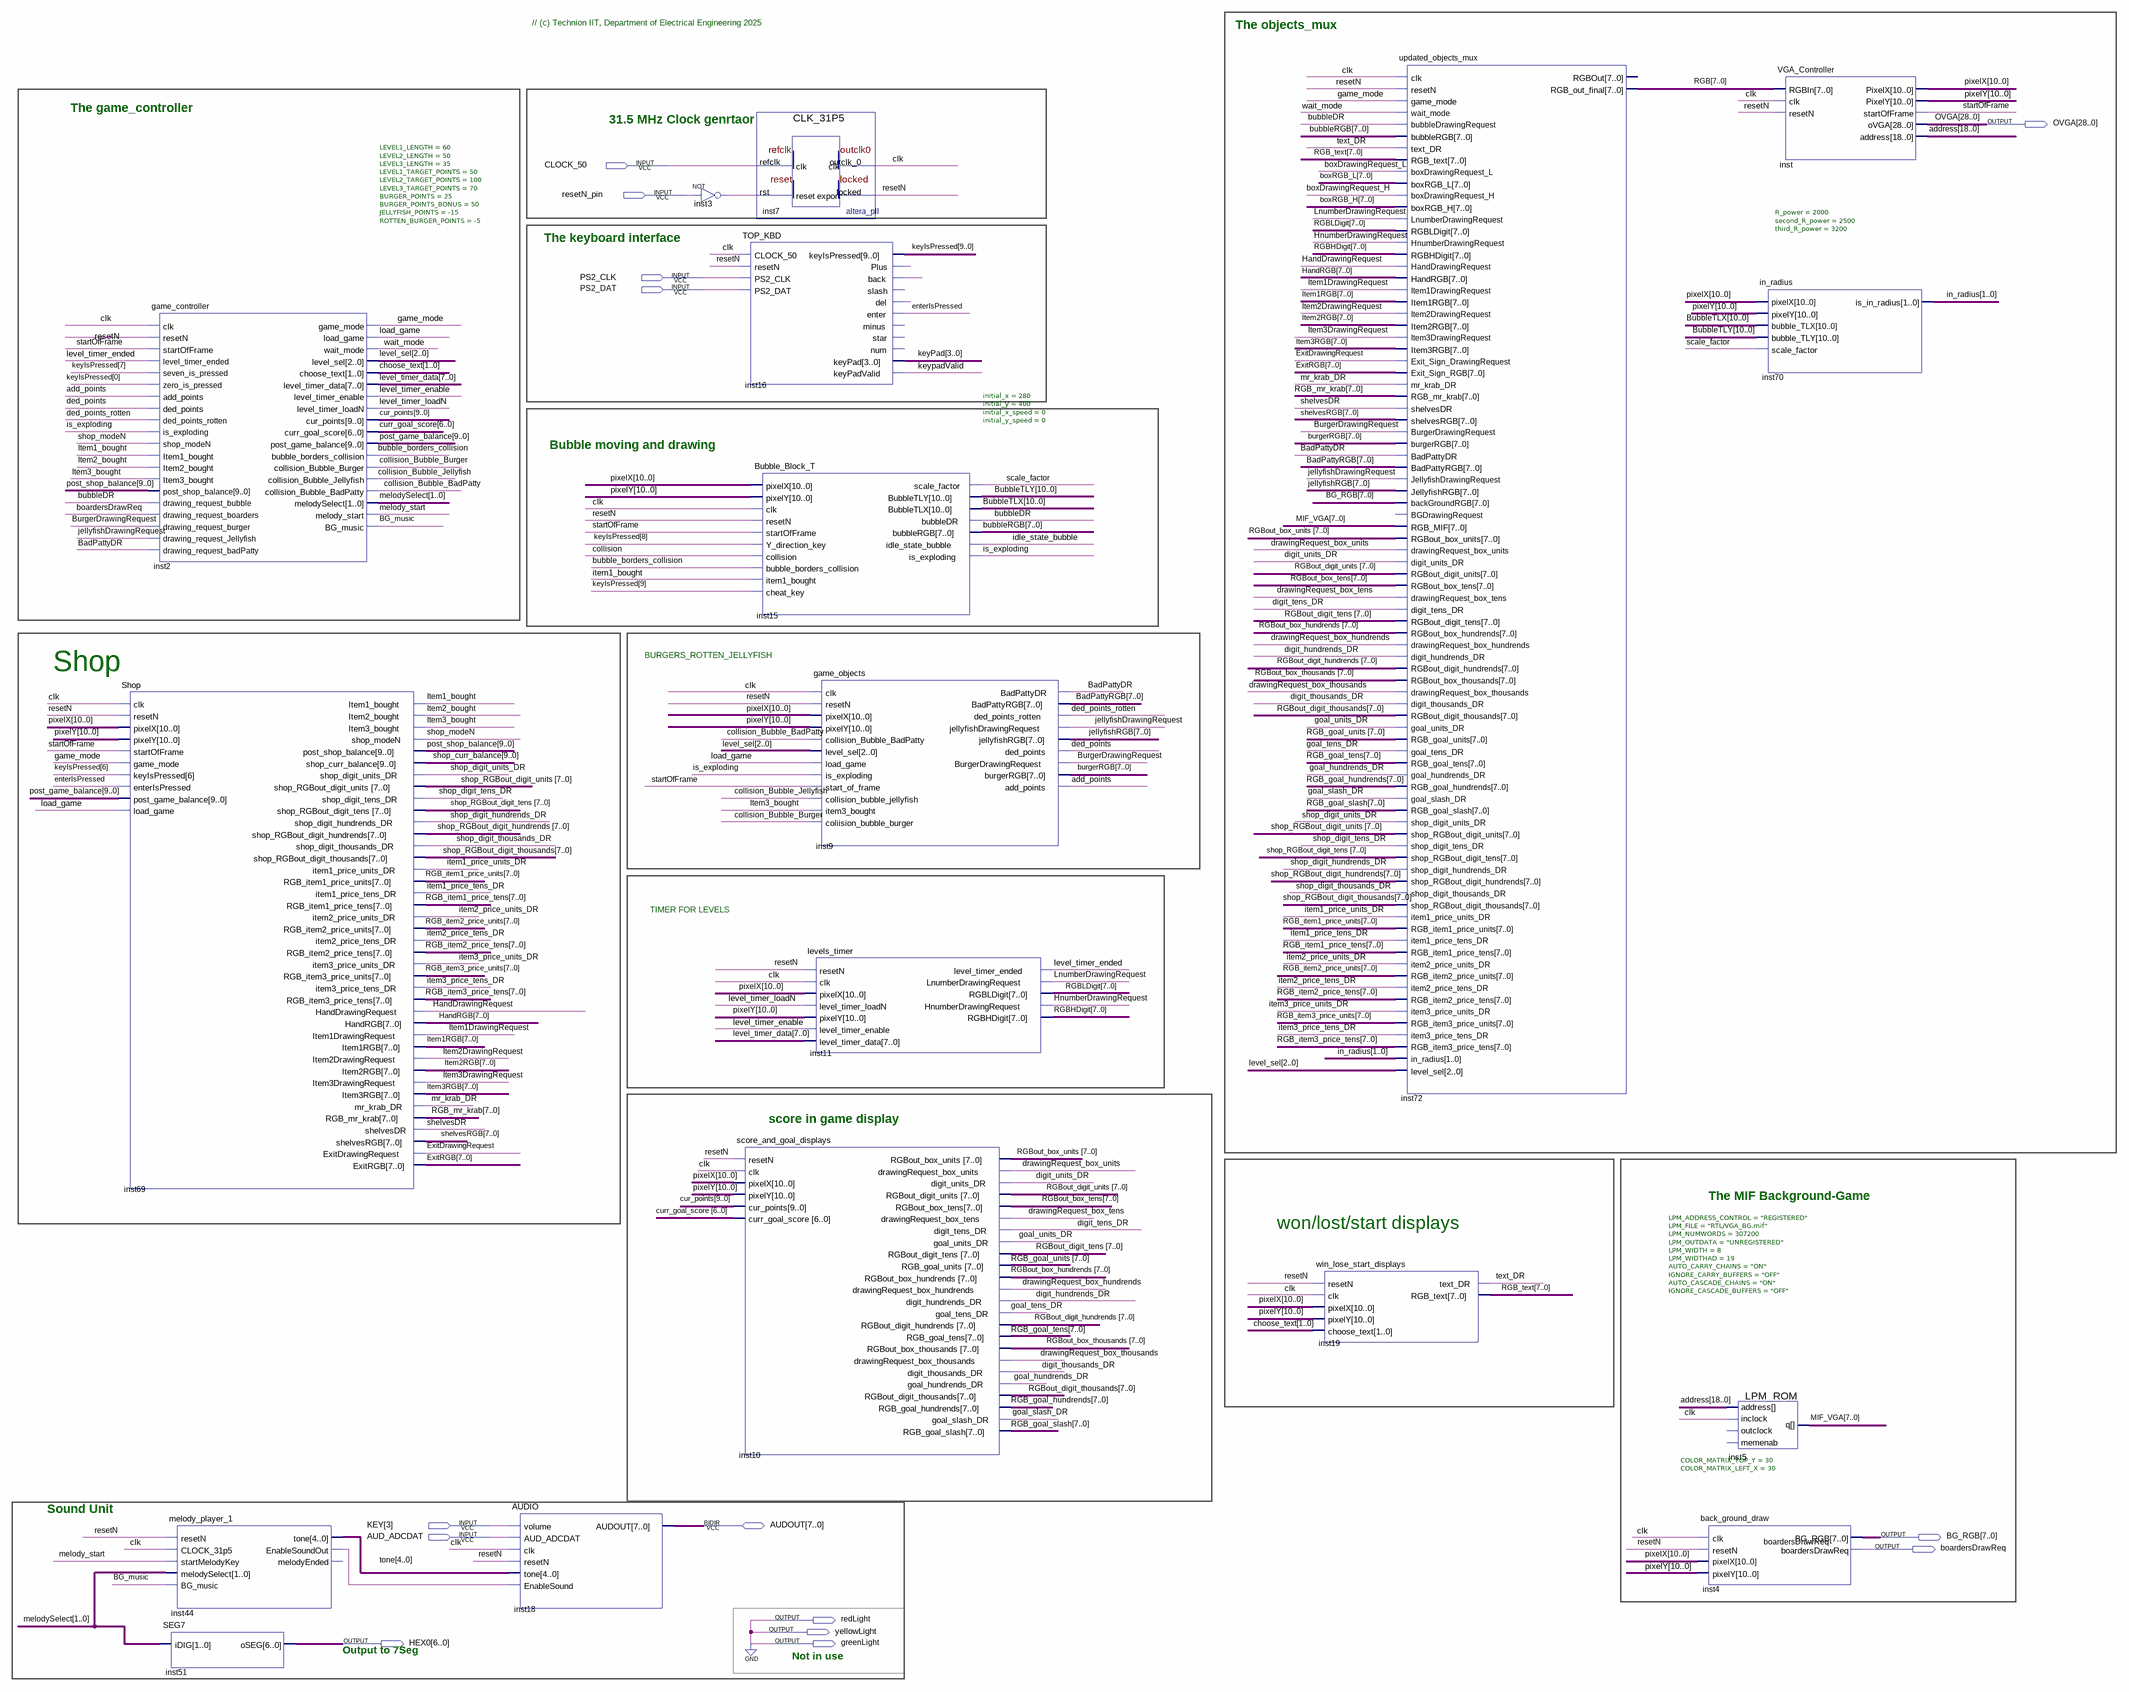
[diagram p0: schematic sheet]
// Quartus schematic TOP_VGA_DEMO_KBD.bdf as structural Verilog: 18 symbols, 14 pins
module TOP_VGA_DEMO_KBD (
  input  CLOCK_50,
  input  resetN_pin,
  input  PS2_CLK,
  input  PS2_DAT,
  input  [3:3] KEY,
  input  AUD_ADCDAT,
  inout  [7:0] AUDOUT,
  output [28:0] OVGA,
  output [7:0] BG_RGB,
  output boardersDrawReq,
  output redLight,
  output yellowLight,
  output [6:0] HEX0,
  output greenLight
);

  wire add_points, BadPattyDR, BG_music, boxDrawingRequest_H, boxDrawingRequest_L, bubble_borders_collision,
       bubbleDR, BurgerDrawingRequest, clk, collision, collision_Bubble_BadPatty, collision_Bubble_Burger,
       collision_Bubble_Jellyfish, ded_points, ded_points_rotten, digit_hundrends_DR, digit_tens_DR,
       digit_thousands_DR, digit_units_DR, drawingRequest_box_hundrends, drawingRequest_box_tens,
       drawingRequest_box_thousands, drawingRequest_box_units, enterIsPressed, ExitDrawingRequest, game_mode,
       goal_hundrends_DR, goal_slash_DR, goal_tens_DR, goal_units_DR, HandDrawingRequest,
       HnumberDrawingRequest, idle_state_bubble, inst3_out, inst16_back, inst16_del, inst16_plus,
       inst44_enablesoundout, is_exploding, Item1_bought, item1_price_tens_DR, item1_price_units_DR,
       Item1DrawingRequest, Item2_bought, item2_price_tens_DR, item2_price_units_DR, Item2DrawingRequest,
       Item3_bought, item3_price_tens_DR, item3_price_units_DR, Item3DrawingRequest, jellyfishDrawingRequest,
       keypadValid, level_timer_enable, level_timer_ended, level_timer_loadN, LnumberDrawingRequest,
       load_game, melody_start, mr_krab_DR, resetN, scale_factor, shelvesDR, shop_digit_hundrends_DR,
       shop_digit_tens_DR, shop_digit_thousands_DR, shop_digit_units_DR, shop_modeN, startOfFrame, text_DR,
       wait_mode;
  wire [1:0] choose_text, in_radius, melodySelect;
  wire [2:0] level_sel;
  wire [3:0] keyPad;
  wire [4:0] tone;
  wire [6:0] curr_goal_score;
  wire [7:0] BadPattyRGB, boxRGB_H, boxRGB_L, bubbleRGB, burgerRGB, ExitRGB, HandRGB, Item1RGB, Item2RGB,
       Item3RGB, jellyfishRGB, level_timer_data, MIF_VGA, RGB, RGB_goal_hundrends, RGB_goal_slash,
       RGB_goal_tens, RGB_goal_units, RGB_item1_price_tens, RGB_item1_price_units, RGB_item2_price_tens,
       RGB_item2_price_units, RGB_item3_price_tens, RGB_item3_price_units, RGB_mr_krab, RGB_text, RGBHDigit,
       RGBLDigit, RGBout_box_hundrends, RGBout_box_tens, RGBout_box_thousands, RGBout_box_units,
       RGBout_digit_hundrends, RGBout_digit_tens, RGBout_digit_thousands, RGBout_digit_units, shelvesRGB,
       shop_RGBout_digit_hundrends, shop_RGBout_digit_tens, shop_RGBout_digit_thousands,
       shop_RGBout_digit_units;
  wire [9:0] cur_points, keyIsPressed, post_game_balance, post_shop_balance, shop_curr_balance;
  wire [10:0] BubbleTLX, BubbleTLY, pixelX, pixelY;
  wire [18:0] address;

  Shop inst69 (
    .clk(clk), .resetN(resetN), .pixelX(pixelX), .pixelY(pixelY), .startOfFrame(startOfFrame),
    .game_mode(game_mode), .keyIsPressed(keyIsPressed[6]), .enterIsPressed(enterIsPressed),
    .post_game_balance(post_game_balance), .load_game(load_game), .Item1_bought(Item1_bought),
    .Item2_bought(Item2_bought), .Item3_bought(Item3_bought), .shop_modeN(shop_modeN),
    .post_shop_balance(post_shop_balance), .shop_curr_balance(shop_curr_balance),
    .shop_digit_units_DR(shop_digit_units_DR), .shop_RGBout_digit_units(shop_RGBout_digit_units),
    .shop_digit_tens_DR(shop_digit_tens_DR), .shop_RGBout_digit_tens(shop_RGBout_digit_tens),
    .shop_digit_hundrends_DR(shop_digit_hundrends_DR),
    .shop_RGBout_digit_hundrends(shop_RGBout_digit_hundrends),
    .shop_digit_thousands_DR(shop_digit_thousands_DR),
    .shop_RGBout_digit_thousands(shop_RGBout_digit_thousands), .item1_price_units_DR(item1_price_units_DR),
    .RGB_item1_price_units(RGB_item1_price_units), .item1_price_tens_DR(item1_price_tens_DR),
    .RGB_item1_price_tens(RGB_item1_price_tens), .item2_price_units_DR(item2_price_units_DR),
    .RGB_item2_price_units(RGB_item2_price_units), .item2_price_tens_DR(item2_price_tens_DR),
    .RGB_item2_price_tens(RGB_item2_price_tens), .item3_price_units_DR(item3_price_units_DR),
    .RGB_item3_price_units(RGB_item3_price_units), .item3_price_tens_DR(item3_price_tens_DR),
    .RGB_item3_price_tens(RGB_item3_price_tens), .HandDrawingRequest(HandDrawingRequest), .HandRGB(HandRGB),
    .Item1DrawingRequest(Item1DrawingRequest), .Item1RGB(Item1RGB),
    .Item2DrawingRequest(Item2DrawingRequest), .Item2RGB(Item2RGB),
    .Item3DrawingRequest(Item3DrawingRequest), .Item3RGB(Item3RGB), .mr_krab_DR(mr_krab_DR),
    .RGB_mr_krab(RGB_mr_krab), .shelvesDR(shelvesDR), .shelvesRGB(shelvesRGB),
    .ExitDrawingRequest(ExitDrawingRequest), .ExitRGB(ExitRGB));
  game_controller #(.LEVEL1_LENGTH(60), .LEVEL2_LENGTH(50), .LEVEL3_LENGTH(35), .LEVEL1_TARGET_POINTS(50), .LEVEL2_TARGET_POINTS(100), .LEVEL3_TARGET_POINTS(70), .BURGER_POINTS(25), .BURGER_POINTS_BONUS(50), .JELLYFISH_POINTS(-15), .ROTTEN_BURGER_POINTS(-5)) inst2 (
    .clk(clk), .resetN(resetN), .startOfFrame(startOfFrame), .level_timer_ended(level_timer_ended),
    .seven_is_pressed(keyIsPressed[7]), .zero_is_pressed(keyIsPressed[0]), .add_points(add_points),
    .ded_points(ded_points), .ded_points_rotten(ded_points_rotten), .is_exploding(is_exploding),
    .shop_modeN(shop_modeN), .Item1_bought(Item1_bought), .Item2_bought(Item2_bought),
    .Item3_bought(Item3_bought), .post_shop_balance(post_shop_balance), .drawing_request_bubble(bubbleDR),
    .drawing_request_boarders(boardersDrawReq), .drawing_request_burger(BurgerDrawingRequest),
    .drawing_request_Jellyfish(jellyfishDrawingRequest), .drawing_request_badPatty(BadPattyDR),
    .game_mode(game_mode), .load_game(load_game), .wait_mode(wait_mode), .level_sel(level_sel),
    .choose_text(choose_text), .level_timer_data(level_timer_data), .level_timer_enable(level_timer_enable),
    .level_timer_loadN(level_timer_loadN), .cur_points(cur_points), .curr_goal_score(curr_goal_score),
    .post_game_balance(post_game_balance), .bubble_borders_collision(bubble_borders_collision),
    .collision_Bubble_Burger(collision_Bubble_Burger),
    .collision_Bubble_Jellyfish(collision_Bubble_Jellyfish),
    .collision_Bubble_BadPatty(collision_Bubble_BadPatty), .melodySelect(melodySelect),
    .melody_start(melody_start), .BG_music(BG_music));
  melody_player_1 inst44 (
    .resetN(resetN), .CLOCK_31p5(clk), .startMelodyKey(melody_start), .melodySelect(melodySelect),
    .BG_music(BG_music), .tone(tone), .EnableSoundOut(inst44_enablesoundout));  // open: melodyEnded
  SEG7 inst51 (.iDIG(melodySelect), .oSEG(HEX0));
  AUDIO inst18 (
    .volume(KEY[3]), .AUD_ADCDAT(AUD_ADCDAT), .clk(clk), .resetN(resetN), .tone(tone),
    .EnableSound(inst44_enablesoundout), .AUDOUT(AUDOUT));
  not inst3 (inst3_out, resetN_pin);
  score_and_goal_displays inst10 (
    .resetN(resetN), .clk(clk), .pixelX(pixelX), .pixelY(pixelY), .cur_points(cur_points),
    .curr_goal_score(curr_goal_score), .RGBout_box_units(RGBout_box_units),
    .drawingRequest_box_units(drawingRequest_box_units), .digit_units_DR(digit_units_DR),
    .RGBout_digit_units(RGBout_digit_units), .RGBout_box_tens(RGBout_box_tens),
    .drawingRequest_box_tens(drawingRequest_box_tens), .digit_tens_DR(digit_tens_DR),
    .goal_units_DR(goal_units_DR), .RGBout_digit_tens(RGBout_digit_tens), .RGB_goal_units(RGB_goal_units),
    .RGBout_box_hundrends(RGBout_box_hundrends), .drawingRequest_box_hundrends(drawingRequest_box_hundrends),
    .digit_hundrends_DR(digit_hundrends_DR), .goal_tens_DR(goal_tens_DR),
    .RGBout_digit_hundrends(RGBout_digit_hundrends), .RGB_goal_tens(RGB_goal_tens),
    .RGBout_box_thousands(RGBout_box_thousands), .drawingRequest_box_thousands(drawingRequest_box_thousands),
    .digit_thousands_DR(digit_thousands_DR), .goal_hundrends_DR(goal_hundrends_DR),
    .RGBout_digit_thousands(RGBout_digit_thousands), .RGB_goal_hundrends(RGB_goal_hundrends),
    .goal_slash_DR(goal_slash_DR), .RGB_goal_slash(RGB_goal_slash));
  CLK_31P5 inst7 (.refclk(CLOCK_50), .rst(inst3_out), .outclk_0(clk), .locked(resetN));
  TOP_KBD inst16 (
    .CLOCK_50(clk), .resetN(resetN), .PS2_CLK(PS2_CLK), .PS2_DAT(PS2_DAT), .keyIsPressed(keyIsPressed),
    .Plus(inst16_plus), .back(inst16_back), .del(inst16_del), .enter(enterIsPressed), .keyPad(keyPad),
    .keyPadValid(keypadValid));  // open: slash, minus, star, num
  Bubble_Block_T #(.initial_x(280), .initial_y(400), .initial_x_speed(0), .initial_y_speed(0)) inst15 (
    .pixelX(pixelX), .pixelY(pixelY), .clk(clk), .resetN(resetN), .startOfFrame(startOfFrame),
    .Y_direction_key(keyIsPressed[8]), .collision(collision),
    .bubble_borders_collision(bubble_borders_collision), .item1_bought(Item1_bought),
    .cheat_key(keyIsPressed[9]), .scale_factor(scale_factor), .BubbleTLY(BubbleTLY), .BubbleTLX(BubbleTLX),
    .bubbleDR(bubbleDR), .bubbleRGB(bubbleRGB), .idle_state_bubble(idle_state_bubble),
    .is_exploding(is_exploding));
  game_objects inst9 (
    .clk(clk), .resetN(resetN), .pixelX(pixelX), .pixelY(pixelY),
    .collision_Bubble_BadPatty(collision_Bubble_BadPatty), .level_sel(level_sel), .load_game(load_game),
    .is_exploding(is_exploding), .start_of_frame(startOfFrame),
    .collision_bubble_jellyfish(collision_Bubble_Jellyfish), .item3_bought(Item3_bought),
    .coliision_bubble_burger(collision_Bubble_Burger), .BadPattyDR(BadPattyDR), .BadPattyRGB(BadPattyRGB),
    .ded_points_rotten(ded_points_rotten), .jellyfishDrawingRequest(jellyfishDrawingRequest),
    .jellyfishRGB(jellyfishRGB), .ded_points(ded_points), .BurgerDrawingRequest(BurgerDrawingRequest),
    .burgerRGB(burgerRGB), .add_points(add_points));
  levels_timer inst11 (
    .resetN(resetN), .clk(clk), .pixelX(pixelX), .level_timer_loadN(level_timer_loadN), .pixelY(pixelY),
    .level_timer_enable(level_timer_enable), .level_timer_data(level_timer_data),
    .level_timer_ended(level_timer_ended), .LnumberDrawingRequest(LnumberDrawingRequest),
    .RGBLDigit(RGBLDigit), .HnumberDrawingRequest(HnumberDrawingRequest), .RGBHDigit(RGBHDigit));
  win_lose_start_displays inst19 (
    .resetN(resetN), .clk(clk), .pixelX(pixelX), .pixelY(pixelY), .choose_text(choose_text),
    .text_DR(text_DR), .RGB_text(RGB_text));
  updated_objects_mux inst72 (
    .clk(clk), .resetN(resetN), .game_mode(game_mode), .wait_mode(wait_mode),
    .bubbleDrawingRequest(bubbleDR), .bubbleRGB(bubbleRGB), .text_DR(text_DR), .RGB_text(RGB_text),
    .boxDrawingRequest_L(boxDrawingRequest_L), .boxRGB_L(boxRGB_L),
    .boxDrawingRequest_H(boxDrawingRequest_H), .boxRGB_H(boxRGB_H),
    .LnumberDrawingRequest(LnumberDrawingRequest), .RGBLDigit(RGBLDigit),
    .HnumberDrawingRequest(HnumberDrawingRequest), .RGBHDigit(RGBHDigit),
    .HandDrawingRequest(HandDrawingRequest), .HandRGB(HandRGB), .Item1DrawingRequest(Item1DrawingRequest),
    .Item1RGB(Item1RGB), .Item2DrawingRequest(Item2DrawingRequest), .Item2RGB(Item2RGB),
    .Item3DrawingRequest(Item3DrawingRequest), .Item3RGB(Item3RGB),
    .Exit_Sign_DrawingRequest(ExitDrawingRequest), .Exit_Sign_RGB(ExitRGB), .mr_krab_DR(mr_krab_DR),
    .RGB_mr_krab(RGB_mr_krab), .shelvesDR(shelvesDR), .shelvesRGB(shelvesRGB),
    .BurgerDrawingRequest(BurgerDrawingRequest), .burgerRGB(burgerRGB), .BadPattyDR(BadPattyDR),
    .BadPattyRGB(BadPattyRGB), .JellyfishDrawingRequest(jellyfishDrawingRequest),
    .JellyfishRGB(jellyfishRGB), .backGroundRGB(BG_RGB), .RGB_MIF(MIF_VGA),
    .RGBout_box_units(RGBout_box_units), .drawingRequest_box_units(drawingRequest_box_units),
    .digit_units_DR(digit_units_DR), .RGBout_digit_units(RGBout_digit_units),
    .RGBout_box_tens(RGBout_box_tens), .drawingRequest_box_tens(drawingRequest_box_tens),
    .digit_tens_DR(digit_tens_DR), .RGBout_digit_tens(RGBout_digit_tens),
    .RGBout_box_hundrends(RGBout_box_hundrends), .drawingRequest_box_hundrends(drawingRequest_box_hundrends),
    .digit_hundrends_DR(digit_hundrends_DR), .RGBout_digit_hundrends(RGBout_digit_hundrends),
    .RGBout_box_thousands(RGBout_box_thousands), .drawingRequest_box_thousands(drawingRequest_box_thousands),
    .digit_thousands_DR(digit_thousands_DR), .RGBout_digit_thousands(RGBout_digit_thousands),
    .goal_units_DR(goal_units_DR), .RGB_goal_units(RGB_goal_units), .goal_tens_DR(goal_tens_DR),
    .RGB_goal_tens(RGB_goal_tens), .goal_hundrends_DR(goal_hundrends_DR),
    .RGB_goal_hundrends(RGB_goal_hundrends), .goal_slash_DR(goal_slash_DR), .RGB_goal_slash(RGB_goal_slash),
    .shop_digit_units_DR(shop_digit_units_DR), .shop_RGBout_digit_units(shop_RGBout_digit_units),
    .shop_digit_tens_DR(shop_digit_tens_DR), .shop_RGBout_digit_tens(shop_RGBout_digit_tens),
    .shop_digit_hundrends_DR(shop_digit_hundrends_DR),
    .shop_RGBout_digit_hundrends(shop_RGBout_digit_hundrends),
    .shop_digit_thousands_DR(shop_digit_thousands_DR),
    .shop_RGBout_digit_thousands(shop_RGBout_digit_thousands), .item1_price_units_DR(item1_price_units_DR),
    .RGB_item1_price_units(RGB_item1_price_units), .item1_price_tens_DR(item1_price_tens_DR),
    .RGB_item1_price_tens(RGB_item1_price_tens), .item2_price_units_DR(item2_price_units_DR),
    .RGB_item2_price_units(RGB_item2_price_units), .item2_price_tens_DR(item2_price_tens_DR),
    .RGB_item2_price_tens(RGB_item2_price_tens), .item3_price_units_DR(item3_price_units_DR),
    .RGB_item3_price_units(RGB_item3_price_units), .item3_price_tens_DR(item3_price_tens_DR),
    .RGB_item3_price_tens(RGB_item3_price_tens), .in_radius(in_radius), .level_sel(level_sel),
    .RGB_out_final(RGB));  // open: BGDrawingRequest, RGBOut
  LPM_ROM #(.LPM_ADDRESS_CONTROL("REGISTERED"), .LPM_FILE("RTL/VGA_BG.mif"), .LPM_NUMWORDS(307200), .LPM_OUTDATA("UNREGISTERED"), .LPM_WIDTH(8), .LPM_WIDTHAD(19), .AUTO_CARRY_CHAINS("ON"), .IGNORE_CARRY_BUFFERS("OFF"), .AUTO_CASCADE_CHAINS("ON"), .IGNORE_CASCADE_BUFFERS("OFF")) inst5 (
    .address(address), .inclock(clk), .q(MIF_VGA));  // open: outclock, memenab
  back_ground_draw #(.COLOR_MATRIX_TOP_Y(30), .COLOR_MATRIX_LEFT_X(30)) inst4 (
    .clk(clk), .resetN(resetN), .pixelX(pixelX), .pixelY(pixelY), .BG_RGB(BG_RGB),
    .boardersDrawReq(boardersDrawReq));
  VGA_Controller inst (
    .RGBIn(RGB), .clk(clk), .resetN(resetN), .PixelX(pixelX), .PixelY(pixelY), .startOfFrame(startOfFrame),
    .oVGA(OVGA), .address(address));
  in_radius #(.R_power(2000), .second_R_power(2500), .third_R_power(3200)) inst70 (
    .pixelX(pixelX), .pixelY(pixelY), .bubble_TLX(BubbleTLX), .bubble_TLY(BubbleTLY),
    .scale_factor(scale_factor), .is_in_radius(in_radius));

  assign greenLight = 1'b0;
  assign redLight = 1'b0;
  assign yellowLight = 1'b0;

  // Notes on the sheet:
  //   // (c) Technion IIT, Department of Electrical Engineering 2025
  //   The objects_mux 
  //   The game_controller 
  //   31.5 MHz Clock genrtaor
  //   The keyboard interface
  //   Bubble moving and drawing
  //   Shop
  //   BURGERS_ROTTEN_JELLYFISH 
  //   TIMER FOR LEVELS
  //   score in game display
  //   The MIF Background-Game
  //   won/lost/start displays
  //   Sound Unit
  //   Output to 7Seg
  //   Not in use
endmodule
